# EAGLE design bebox_main_trinket (EAGLE 9.3.2)
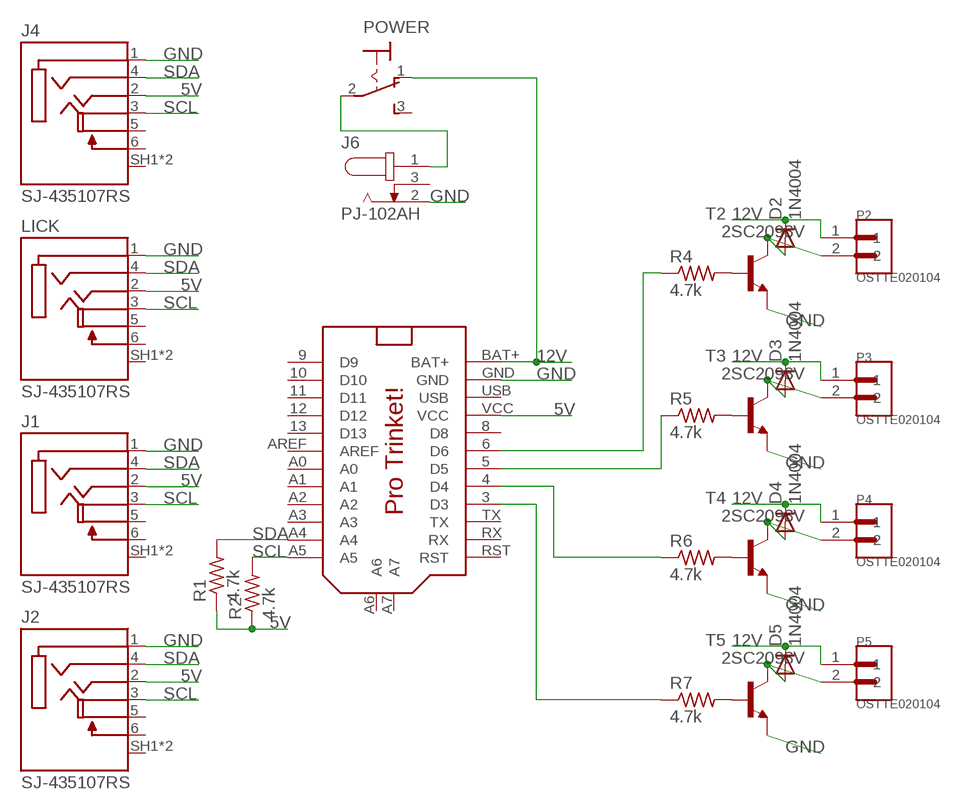
[diagram p0: schematic, sheet 1]

## Parts
D2  1N4004  [DO41-10]
D3  1N4004  [DO41-10]
D4  1N4004  [DO41-10]
D5  1N4004  [DO41-10]
J1  SJ-435107RS  [CUI_SJ-435107RS]
J2  SJ-435107RS  [CUI_SJ-435107RS]
J4  SJ-435107RS  [CUI_SJ-435107RS]
J6  PJ-102AH  [CUI_PJ-102AH]
LICK  SJ-435107RS  [CUI_SJ-435107RS]
P2  OSTTE020104  [OST_OSTTE020104]
P3  OSTTE020104  [OST_OSTTE020104]
P4  OSTTE020104  [OST_OSTTE020104]
P5  OSTTE020104  [OST_OSTTE020104]
POWER  SWITCH_APEM_5636AB9  [320-916]
R1  4.7k  R-US_0207/10  [0207/10]
R2  4.7k  R-US_0207/10  [0207/10]
R4  4.7k  R-US_0207/10  [0207/10]
R5  4.7k  R-US_0207/10  [0207/10]
R6  4.7k  R-US_0207/10  [0207/10]
R7  4.7k  R-US_0207/10  [0207/10]
T2  2SC2098V  [TO220AV]
T3  2SC2098V  [TO220AV]
T4  2SC2098V  [TO220AV]
T5  2SC2098V  [TO220AV]
U$1  PRO_TRINKET  [PROTRINKET]

## Nets
5V: J1.2(TIP) J2.2(TIP) J4.2(TIP) LICK.2(TIP) R1.1 R2.1 U$1.VCC
12V: D2.C D3.C D4.C D5.C P2.1 P3.1 P4.1 P5.1 POWER.1(O) U$1.BAT+
GND: J1.1(SLEEVE) J2.1(SLEEVE) J4.1(SLEEVE) J6.2 LICK.1(SLEEVE) T2.3(E) T3.3(E) T4.3(E) T5.3(E) U$1.GND
N$1: J6.1 POWER.2(P)
N$4: R4.2 T2.1(B)
N$5: D2.A P2.2 T2.2(C)
N$6: R5.2 T3.1(B)
N$7: D3.A P3.2 T3.2(C)
N$8: R6.2 T4.1(B)
N$9: D4.A P4.2 T4.2(C)
N$10: R7.2 T5.1(B)
N$11: D5.A P5.2 T5.2(C)
N$12: R7.1 U$1.3(D3)
N$13: R6.1 U$1.4(D4)
N$14: R5.1 U$1.5(D5)
N$15: R4.1 U$1.6(D6)
SCL: J1.3(RING1) J2.3(RING1) J4.3(RING1) LICK.3(RING1) R2.2 U$1.A5
SDA: J1.4(RING2) J2.4(RING2) J4.4(RING2) LICK.4(RING2) R1.2 U$1.A4
Unconnected: J1.5(ISOLATED_RING1) J1.6(ISOLATED_RING1_SWITCH(N-O)) J1.SH1(SHIELD) J1.SH2(SHIELD) J2.5(ISOLATED_RING1) J2.6(ISOLATED_RING1_SWITCH(N-O)) J2.SH1(SHIELD) J2.SH2(SHIELD) J4.5(ISOLATED_RING1) J4.6(ISOLATED_RING1_SWITCH(N-O)) J4.SH1(SHIELD) J4.SH2(SHIELD) J6.3 LICK.5(ISOLATED_RING1) LICK.6(ISOLATED_RING1_SWITCH(N-O)) LICK.SH1(SHIELD) LICK.SH2(SHIELD) POWER.3(S) U$1.8(D8) U$1.9(D9) U$1.10(D10) U$1.11(D11) U$1.12(D12) U$1.13(D13) U$1.A0 U$1.A1 U$1.A2 U$1.A3 U$1.A6 U$1.A7 U$1.AREF U$1.RST U$1.RX U$1.TX

## Power pins joined to a net without a drawn wire
USB: U$1.USB

## Library data of the parts
D2-D5 = adafruit:1N4004: DIODE General purpose 1N400x type rectifier (With bigger pads) http://www.ladyada.net/library/pcb/eaglelibrary.html
J1 J2 J4 LICK = SJ-435107RS:SJ-435107RS: 3.5 mm Right Angle Shielded (0.141", 1/8", Mini Plug) Female HeadPhone Jack; AVAILABILITY: Good; DESCRIPTION: 3.5 mm Right Angle Shielded _0.141, 1/8, Mini Plug_ Female HeadPhone Jack; MF: CUI; MP: SJ-435107RS; PACKAGE: None; PRICE: 1.04 USD
J6 = PJ-102AH:PJ-102AH: 2.0 mm Center Pin, 5.0 A, Right Angle, Through Hole, Tapered Pins, Dc Power Jack Connector; MANUFACTURER: CUI INC; PART_REV: 1.02; STANDARD: Manufacturer recommendations
P2-P5 = OSTTE020104:OSTTE020104: Terminal Block 3.5mm 2pos Pcb; DESCRIPTION: Terminal Block 3.5mm 2pos Pcb; DIGI-KEY_PART_NUMBER: ED2740-ND; DIGI-KEY_PURCHASE_URL: https://www.digikey.com/product-detail/en/on-shore-technology-inc/OSTTE020104/ED2740-ND/2351816?utm_source=snapeda&utm_medium=aggregator&utm_campaign=symbol; MF: On Shore; MP: OSTTE020104; PACKAGE: None
POWER = arthur:SWITCH_APEM_5636AB9: TOGGLE SWITCH distributor RS Components
R1 R2 R4-R7 = rcl:R-US_: RESISTOR, American symbol; SPICEPREFIX: R
T2-T5 = transistor:2SC2098: NPN Epitaxial Planar Transistor RF Power Amplivier Source: 2SC2098.pdf
U$1 = Arthur's Library:PRO_TRINKET

## Board
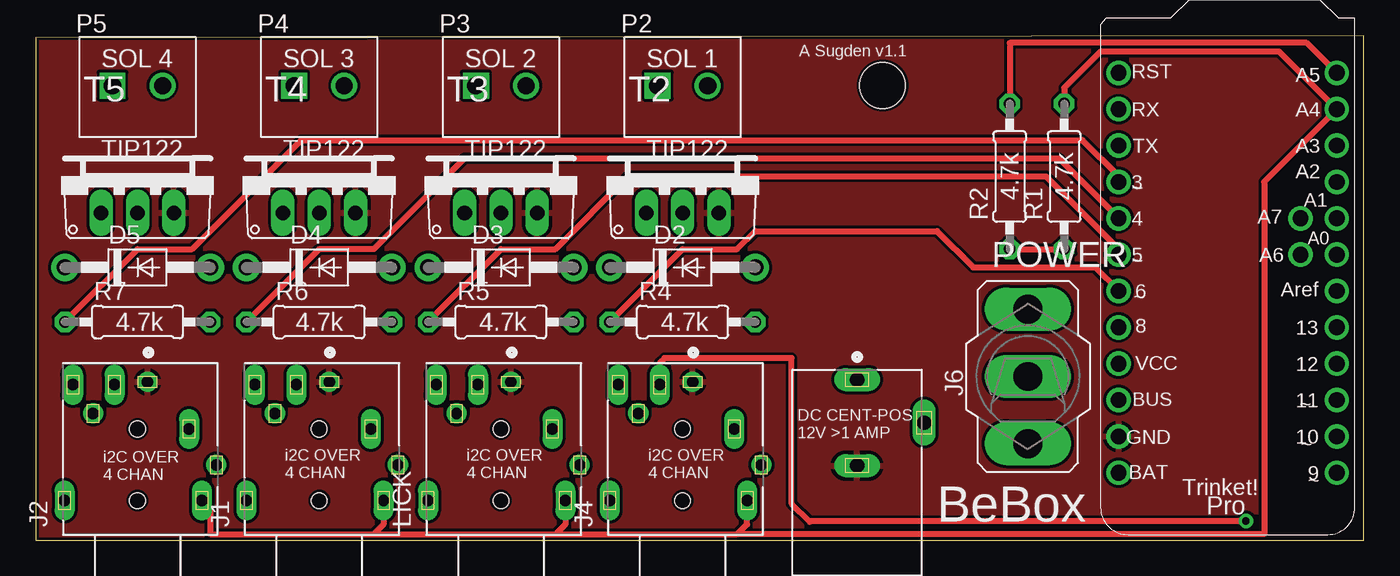
[diagram p1: board, top side]
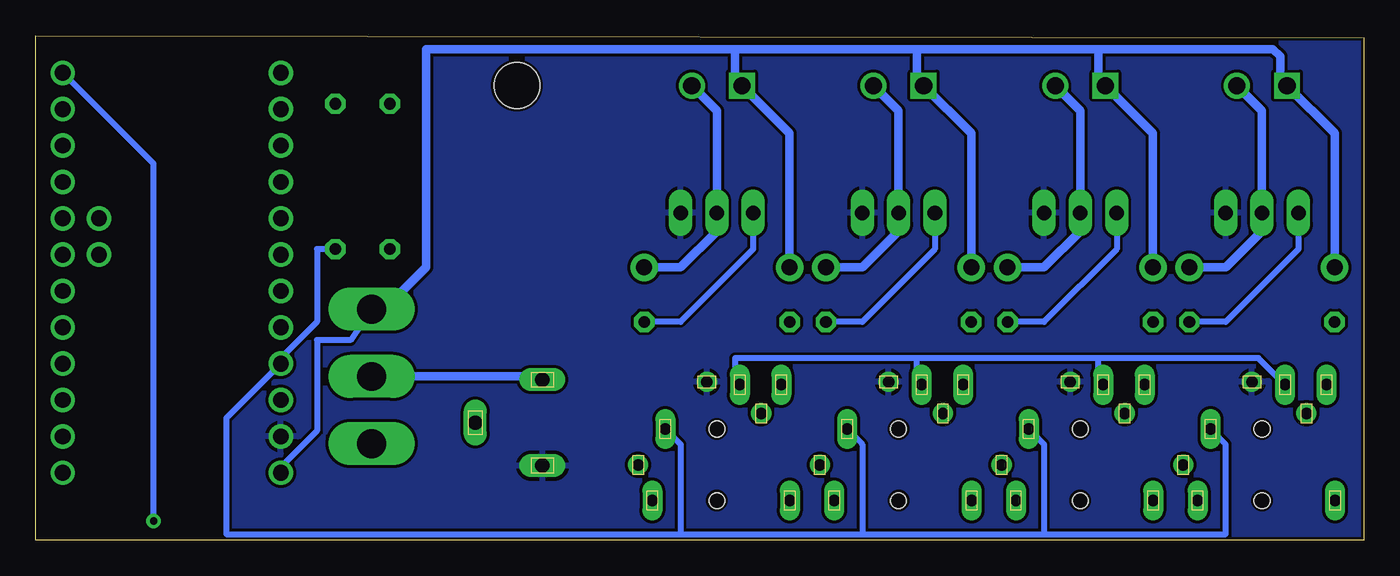
[diagram p2: board, bottom side, seen from below]

Size 92.82 x 35.23 mm. Coordinates in mm from the lower left corner, seen from the top.
Outline: 0,0 92.82,0 92.82,35.23 0,35.1 0,0
Copper layers (1*16): Top 0.035mm / dielectric 1.5mm / Bottom 0.035mm
Design rules "SparkFun": minimum track width 8mil, minimum drill 20mil, track to track 8mil, track to pad 8mil, pad to pad 8mil, via to via 8mil, smd to smd 8mil, copper to edge 8mil, drill to drill 8mil, minimum pad ring 12mil, minimum via ring 10mil, stop-mask expansion 4mil, vias tented up to drill 20mil, thermal gap 10mil
Holes 3.2 mm at 59.18,31.75

### Footprints (pad centres in the part's own frame; a part is rotated, then mirrored left to right if it is on the bottom)
DO41-10 = drill 1.118 pad 1.93: A 5.08,0; C -5.08,0
CUI_SJ-435107RS = drill 0.8 pad 1.1: 1 4.7,-0.7; 5 2.5,3.1; SH2 -1.1,-5.5 | drill 0.8 pad 1.1 long: 2 1.4,-3.6; 3 4.5,1.6; 4 -3.6,-4.5; 6 4.5,4.5; SH1 -3.6,5.1 | hole 1.1: -3.6,0; 1.4,0
CUI_PJ-102AH = drill 1 long: 1 -6.5,0; 2 -0.5,0; 3 -3.5,4.7
OST_OSTTE020104 = drill 1.2 square: 1 -1.75,0 | drill 1.2: 2 1.75,0
320-916 = drill 2.007 long: 1 0,4.699; 2 0,0; 3 0,-4.699
0207/10 = drill 0.813 octagon: 1 -5.08,0; 2 5.08,0
TO220AV = drill 1.016 long: 1 -2.54,-2.54; 2 0,-2.54; 3 2.54,-2.54
PROTRINKET = drill 1.1: 3 7.62,2.921; 4 7.62,5.461; 5 7.62,8.001; 6 7.62,10.541; 8 7.62,13.081; 9 -7.62,23.241; 10 -7.62,20.701; 11 -7.62,18.161; 12 -7.62,15.621; 13 -7.62,13.081; A0 -7.62,8.001; A1 -7.62,5.461; A2 -7.62,2.921; A3 -7.62,0.381; A4 -7.62,-2.159; A5 -7.62,-4.699; A6 -5.08,8.001; A7 -5.08,5.461; AREF -7.62,10.541; BAT+ 7.62,23.241; GND 7.62,20.701; RST 7.62,-4.699; RX 7.62,-2.159; TX 7.62,0.381; USB 7.62,18.161; VCC 7.62,15.621

### Placement (x,y rotation side)
D2  45.21,19.05 0 top
D3  32.51,19.05 0 top
D4  19.81,19.05 0 top
D5  7.11,19.05 0 top
J1  19.81,6.35 90 top
J2  7.11,6.35 90 top
J4  45.21,6.35 90 top
J6  57.4,4.7 270 top
LICK  32.51,6.35 90 top
P2  45.21,31.75 0 top
P3  32.51,31.75 0 top
P4  19.81,31.75 0 top
P5  7.11,31.75 0 top
POWER  69.34,11.43 0 top
R1  71.88,25.4 90 top
R2  68.07,25.4 90 top
R4  45.21,15.24 0 top
R5  32.51,15.24 0 top
R6  19.81,15.24 0 top
R7  7.11,15.24 0 top
T2  45.21,25.4 0 top
T3  32.51,25.4 0 top
T4  19.81,25.4 0 top
T5  7.11,25.4 0 top
U$1  83.31,27.94 180 top

### Tracks (layer width: path | path; a pad name or v marks a point on that pad's centre or on a via)
5V
  Top 0.406: R2.1 R1.1
  Bottom 0.406: R1.1 73.15,20.32 73.15,15.24 75.69,12.7 U$1.VCC 79.5,8.51 79.5,0.41 47.75,0.41 | 47.75,0.41 35.05,0.41 | 35.05,0.41 22.35,0.41 | 22.35,0.41 9.65,0.41 9.65,6.69 J2.2 | J1.2 22.35,6.69 22.35,0.41 | LICK.2 35.05,6.69 35.05,0.41 | J4.2 47.75,6.69 47.75,0.41
12V
  Bottom 0.406: POWER.1 70.81,13.97 73.15,13.97 73.15,7.62 75.69,5.08 U$1.BAT+
  Bottom 0.61: D4.C 14.73,28.42 P4.1 18.54,32.23 18.54,34.29 | D5.C 2.03,28.42 P5.1 5.84,32.23 5.84,33.79 6.34,34.29 18.54,34.29 | D3.C 27.43,28.42 P3.1 31.24,32.23 31.24,34.29 | D2.C 40.13,28.42 P2.1 43.94,32.23 43.94,34.29 | 43.94,34.29 65.53,34.29 65.53,19.05 68.45,16.13 POWER.1 | 43.94,34.29 31.24,34.29 | 31.24,34.29 18.54,34.29
GND
  pour Top: -0.51,35.56 -0.51,0 93.47,0 93.47,35.56
  pour Bottom: -0.51,35.56 -0.51,0 93.47,0 93.47,35.56
N$1
  Bottom 0.61: J6.1 57.64,11.43 POWER.2
N$4
  Bottom 0.406: T2.1 42.67,20.32 47.75,15.24 R4.2
N$5
  Bottom 0.61: P2.2 45.21,30 T2.2 45.21,21.59 47.75,19.05 D2.A
N$6
  Bottom 0.406: T3.1 29.97,20.32 35.05,15.24 R5.2
N$7
  Bottom 0.61: P3.2 32.51,30 T3.2 32.51,21.59 35.05,19.05 D3.A
N$8
  Bottom 0.406: T4.1 17.27,20.32 22.35,15.24 R6.2
N$9
  Bottom 0.61: P4.2 19.81,30 T4.2 19.81,21.59 22.35,19.05 D4.A
N$10
  Bottom 0.406: T5.1 4.57,20.32 9.65,15.24 R7.2
N$11
  Bottom 0.61: P5.2 7.11,30 T5.2 7.11,21.59 9.65,19.05 D5.A
N$12
  Top 0.406: R7.1 7.11,20.32 10.92,20.32 18.54,27.94 73.15,27.94 75.69,25.4 U$1.3
N$13
  Top 0.406: R6.1 19.81,20.32 23.62,20.32 29.97,26.67 71.5,26.67 U$1.4
N$14
  Top 0.406: R5.1 32.51,20.32 36.32,20.32 41.4,25.4 70.61,25.4 75.69,20.32 U$1.5
N$15
  Top 0.406: R4.1 45.21,20.32 49.02,20.32 50.29,21.59 62.99,21.59 65.53,19.05 74.04,19.05 U$1.6
SCL  (via drill 0.51)
  Top 0.406: R2.2 68.07,34.74 88.83,34.74 U$1.A5 | R2.2 | v84.58,1.32 54.15,1.32 54.1,1.27 52.83,2.54 52.83,12.7 43.94,12.7 43.61,12.37 J4.3
  Bottom 0.406: J2.3 7.36,12.7 18.54,12.7 | 18.54,12.7 31.24,12.7 | 31.24,12.7 43.94,12.7 43.94,11.18 J4.3 | LICK.3 31.24,11.18 31.24,12.7 | J1.3 18.54,11.18 18.54,12.7 | v84.58,1.32 84.58,26.29 U$1.A5
SDA
  Top 0.406: R1.2 71.88,31.59 74.42,34.13 86.9,34.13 U$1.A4 85.85,25.02 85.85,0.41 49.02,0.41 | J2.4 12.19,2.17 12.19,0.41 23.62,0.41 | 23.62,0.41 36.32,0.41 | 36.32,0.41 49.02,0.41 | 49.02,0.41 49.71,1.1 J4.4 | LICK.4 37.01,1.1 36.32,0.41 | J1.4 24.31,1.1 23.62,0.41

### Text on the board
tPlace: A Sugden v1.1 | SOL 4 | SOL 3 | SOL 2 | SOL 1 | TIP122 | TIP122 | TIP122 | TIP122 | 4.7k | 4.7k | 4.7k | 4.7k | 4.7k | 4.7k | DC CENT-POS / 12V >1 AMP | i2C OVER / 4 CHAN | i2C OVER / 4 CHAN | i2C OVER / 4 CHAN | i2C OVER / 4 CHAN | BeBox